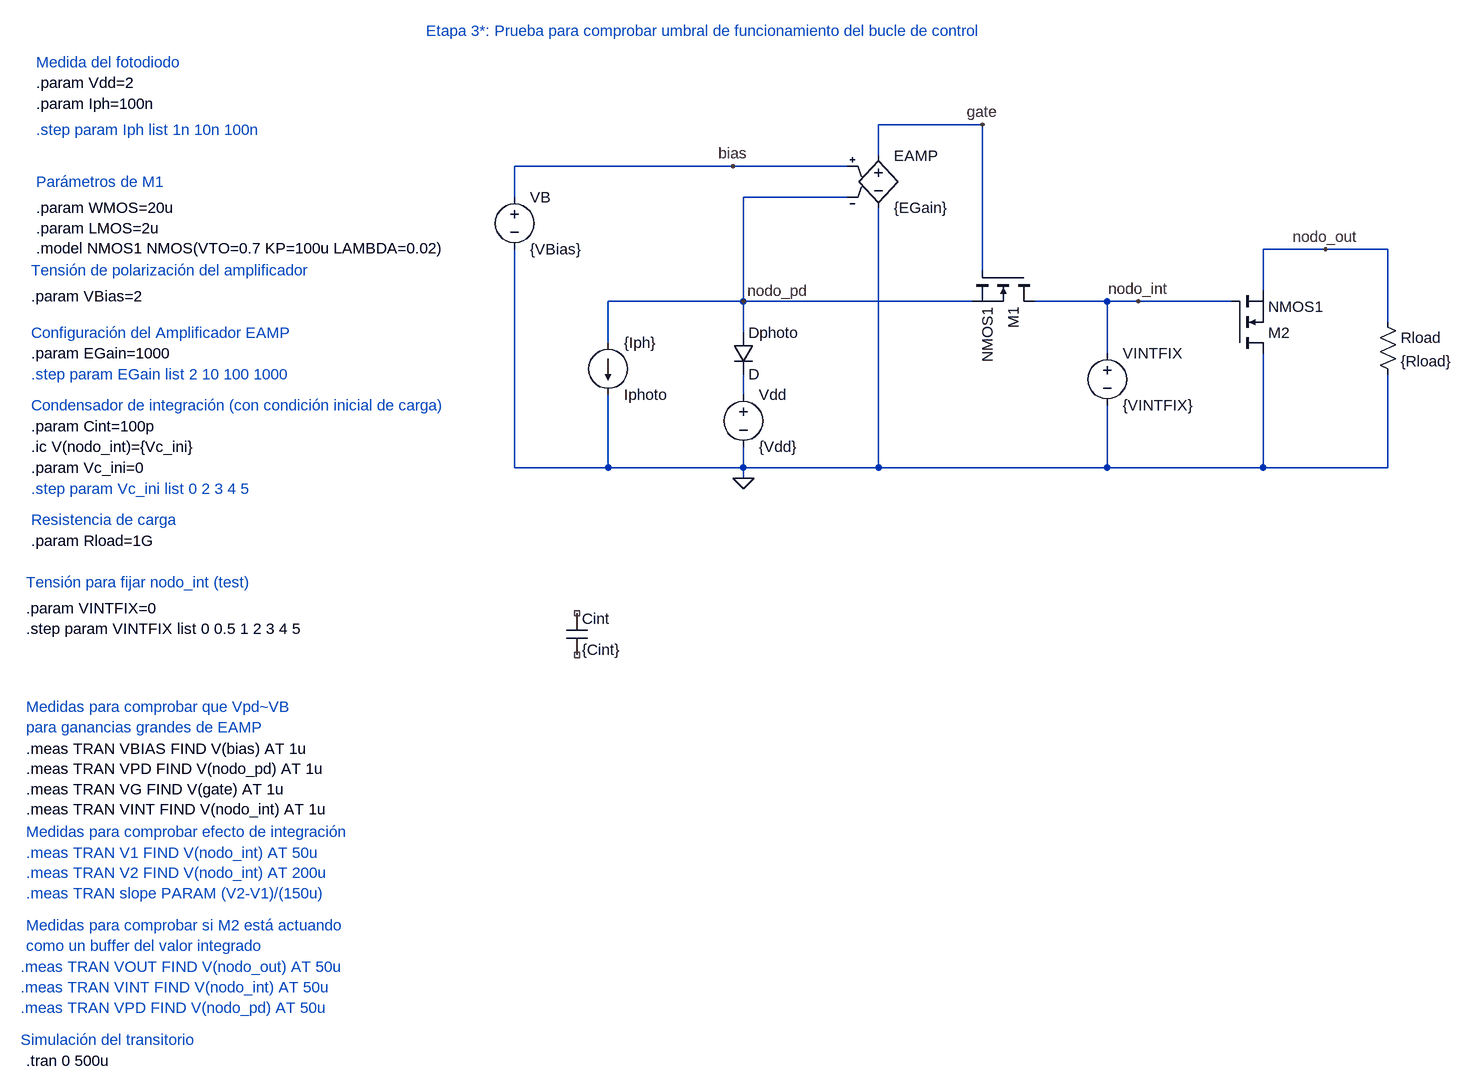
[diagram p0: schematic testUmbral.asc]
testUmbral.asc, the LTspice schematic file:
Version 4.1
SHEET 1 1252 1568
WIRE 480 112 320 112
WIRE 320 160 320 112
WIRE 96 176 -240 176
WIRE 272 176 96 176
WIRE -240 224 -240 176
WIRE 272 224 112 224
WIRE 1008 304 912 304
WIRE 1104 304 1008 304
WIRE 480 336 480 112
WIRE 912 368 912 304
WIRE 112 384 112 224
WIRE 112 384 -96 384
WIRE 464 384 112 384
WIRE 672 384 560 384
WIRE 720 384 672 384
WIRE 864 384 720 384
WIRE 1104 416 1104 304
WIRE 112 432 112 384
WIRE -96 448 -96 384
WIRE 672 464 672 384
WIRE 112 528 112 496
WIRE -240 640 -240 304
WIRE -96 640 -96 528
WIRE -96 640 -240 640
WIRE 112 640 112 608
WIRE 112 640 -96 640
WIRE 320 640 320 240
WIRE 320 640 112 640
WIRE 672 640 672 544
WIRE 672 640 320 640
WIRE 912 640 912 464
WIRE 912 640 672 640
WIRE 1104 640 1104 496
WIRE 1104 640 912 640
WIRE 112 656 112 640
FLAG 112 656 0
FLAG 112 384 nodo_pd
FLAG 480 112 gate
FLAG 96 176 bias
FLAG 720 384 nodo_int
FLAG 1008 304 nodo_out
DATAFLAG -176 176 ""
DATAFLAG 160 224 ""
DATAFLAG 320 112 ""
SYMBOL e 320 144 R0
SYMATTR InstName EAMP
SYMATTR Value {EGain}
SYMBOL voltage -240 208 R0
SYMATTR InstName VB
SYMATTR Value {VBias}
SYMBOL current -96 448 R0
WINDOW 0 24 80 Left 2
WINDOW 3 24 0 Left 2
WINDOW 123 0 0 Left 0
WINDOW 39 0 0 Left 0
SYMATTR InstName Iphoto
SYMATTR Value {Iph}
SYMBOL nmos 560 336 R90
SYMATTR InstName M1
SYMATTR Value NMOS1
SYMATTR SpiceLine L={LMOS} W={WMOS}
SYMBOL voltage 112 512 R0
SYMATTR InstName Vdd
SYMATTR Value {Vdd}
SYMBOL cap -160 864 R0
SYMATTR InstName Cint
SYMATTR Value {Cint}
SYMBOL res 1088 400 R0
SYMATTR InstName Rload
SYMATTR Value {Rload}
SYMBOL diode 96 432 R0
SYMATTR InstName Dphoto
SYMBOL nmos 864 464 M180
SYMATTR InstName M2
SYMATTR Value NMOS1
SYMBOL voltage 672 448 R0
SYMATTR InstName VINTFIX
SYMATTR Value {VINTFIX}
TEXT -376 -32 Left 2 ;Etapa 3*: Prueba para comprobar umbral de funcionamiento del bucle de control
TEXT -976 80 Left 2 !.param Iph=100n
TEXT -976 16 Left 2 ;Medida del fotodiodo
TEXT -976 120 Left 2 ;.step param Iph list 1n 10n 100n
TEXT -976 240 Left 2 !.param WMOS=20u\n.param LMOS=2u\n.model NMOS1 NMOS(VTO=0.7 KP=100u LAMBDA=0.02)
TEXT -976 200 Left 2 ;Parámetros de M1
TEXT -984 376 Left 2 !.param VBias=2
TEXT -984 336 Left 2 ;Tensión de polarización del amplificador
TEXT -992 1008 Left 2 ;Medidas para comprobar que Vpd~VB \npara ganancias grandes de EAMP
TEXT -992 1552 Left 2 !.tran 0 500u
TEXT -992 1072 Left 2 !.meas TRAN VBIAS FIND V(bias) AT 1u\n.meas TRAN VPD FIND V(nodo_pd) AT 1u\n.meas TRAN VG FIND V(gate) AT 1u\n.meas TRAN VINT FIND V(nodo_int) AT 1u
TEXT -976 48 Left 2 !.param Vdd=2
TEXT -984 464 Left 2 !.param EGain=1000
TEXT -984 496 Left 2 ;.step param EGain list 2 10 100 1000
TEXT -984 432 Left 2 ;Configuración del Amplificador EAMP
TEXT -984 608 Left 2 !.ic V(nodo_int)={Vc_ini}
TEXT -984 544 Left 2 ;Condensador de integración (con condición inicial de carga)
TEXT -984 576 Left 2 !.param Cint=100p
TEXT -992 1232 Left 2 ;.meas TRAN V1 FIND V(nodo_int) AT 50u\n.meas TRAN V2 FIND V(nodo_int) AT 200u\n.meas TRAN slope PARAM (V2-V1)/(150u)
TEXT -992 1200 Left 2 ;Medidas para comprobar efecto de integración
TEXT -984 720 Left 2 ;Resistencia de carga
TEXT -984 752 Left 2 !.param Rload=1G
TEXT -1000 1520 Left 2 ;Simulación del transitorio
TEXT -984 640 Left 2 !.param Vc_ini=0
TEXT -984 672 Left 2 ;.step param Vc_ini list 0 2 3 4 5
TEXT -992 1344 Left 2 ;Medidas para comprobar si M2 está actuando \ncomo un buffer del valor integrado
TEXT -1000 1408 Left 2 ;.meas TRAN VOUT FIND V(nodo_out) AT 50u\n.meas TRAN VINT FIND V(nodo_int) AT 50u\n.meas TRAN VPD FIND V(nodo_pd) AT 50u
TEXT -992 888 Left 2 !.step param VINTFIX list 0 0.5 1 2 3 4 5
TEXT -992 856 Left 2 !.param VINTFIX=0
TEXT -992 816 Left 2 ;Tensión para fijar nodo_int (test)

The netlist it stands for:
* testUmbral.asc
EAMP gate 0 bias nodo_pd {EGain}
VB bias 0 {VBias}
Iphoto nodo_pd 0 {Iph}
M1 nodo_int gate nodo_pd nodo_pd NMOS1 L={LMOS} W={WMOS}
Vdd N001 0 {Vdd}
Cint NC_01 NC_02 {Cint}
Rload nodo_out 0 {Rload}
Dphoto nodo_pd N001 D
M2 0 nodo_int nodo_out nodo_out NMOS1
VINTFIX nodo_int 0 {VINTFIX}
.model D D
.lib standard.dio
.model NMOS NMOS
.model PMOS PMOS
.lib standard.mos
* Etapa 3*: Prueba para comprobar umbral de funcionamiento del bucle de control
.param Iph=100n
* Medida del fotodiodo
* .step param Iph list 1n 10n 100n
.param WMOS=20u
.param LMOS=2u
.model NMOS1 NMOS(VTO=0.7 KP=100u LAMBDA=0.02)
* Parámetros de M1
.param VBias=2
* Tensión de polarización del amplificador
* Medidas para comprobar que Vpd~VB
* para ganancias grandes de EAMP
.tran 0 500u
.meas TRAN VBIAS FIND V(bias) AT 1u
.meas TRAN VPD FIND V(nodo_pd) AT 1u
.meas TRAN VG FIND V(gate) AT 1u
.meas TRAN VINT FIND V(nodo_int) AT 1u
.param Vdd=2
.param EGain=1000
* .step param EGain list 2 10 100 1000
* Configuración del Amplificador EAMP
.ic V(nodo_int)={Vc_ini}
* Condensador de integración (con condición inicial de carga)
.param Cint=100p
* .meas TRAN V1 FIND V(nodo_int) AT 50u
* .meas TRAN V2 FIND V(nodo_int) AT 200u
* .meas TRAN slope PARAM (V2-V1)/(150u)
* Medidas para comprobar efecto de integración
* Resistencia de carga
.param Rload=1G
* Simulación del transitorio
.param Vc_ini=0
* .step param Vc_ini list 0 2 3 4 5
* Medidas para comprobar si M2 está actuando
* como un buffer del valor integrado
* .meas TRAN VOUT FIND V(nodo_out) AT 50u
* .meas TRAN VINT FIND V(nodo_int) AT 50u
* .meas TRAN VPD FIND V(nodo_pd) AT 50u
.step param VINTFIX list 0 0.5 1 2 3 4 5
.param VINTFIX=0
* Tensión para fijar nodo_int (test)
.backanno
.end